# EasyEDA schematic SCH_circular-led_2022-01-28.json
TITLE: Sheet_1; REV: 1.0; Date: 2021-02-07; Sheet: 1/1; Drawn By: ferhat1709; Company: Your Company
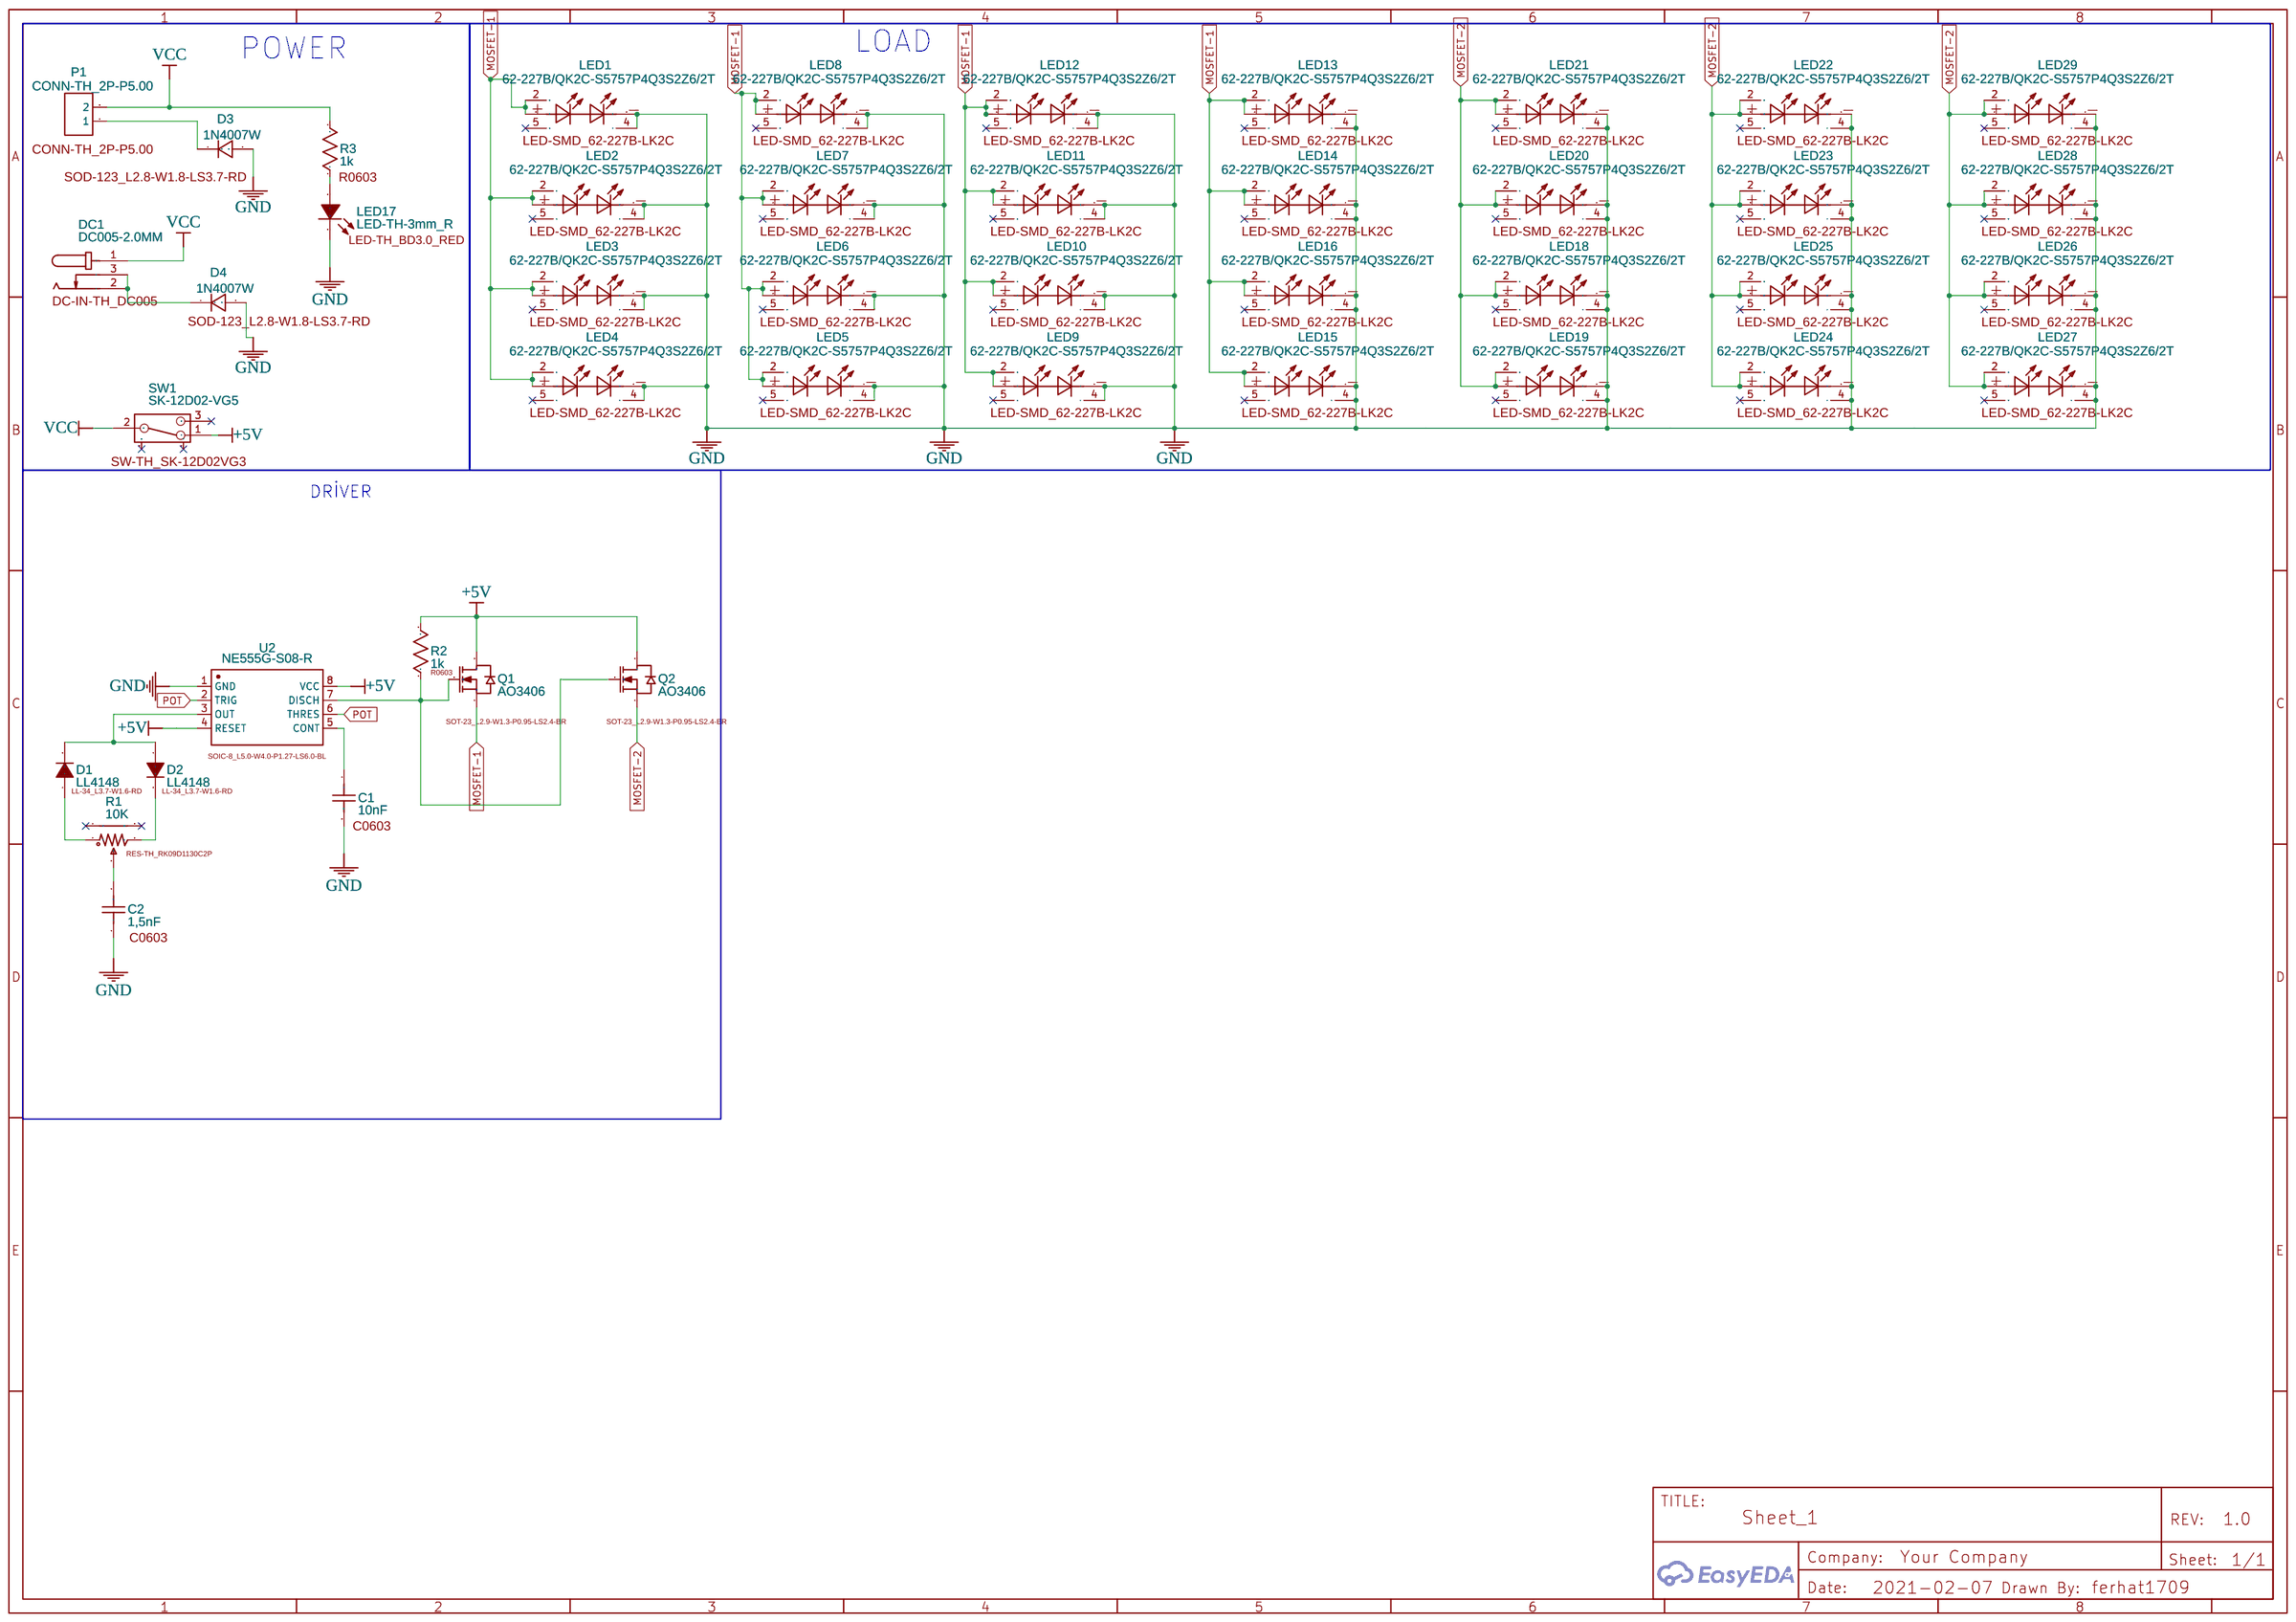
[diagram p0: schematic sheet]

## Parts
C1  10nF  [C0603]
C2  1,5nF  [C0603]
D1  LL4148  [LL-34_L3.7-W1.6-RD]
D2  LL4148  [LL-34_L3.7-W1.6-RD]
D3  1N4007W  [SOD-123_L2.8-W1.8-LS3.7-RD]
D4  1N4007W  [SOD-123_L2.8-W1.8-LS3.7-RD]
DC1  DC005-2.0MM  [DC-IN-TH_DC005]
LED1  62-227B/QK2C-S5757P4Q3S2Z6/2T  [LED-SMD_62-227B-LK2C]
LED2  62-227B/QK2C-S5757P4Q3S2Z6/2T  [LED-SMD_62-227B-LK2C]
LED3  62-227B/QK2C-S5757P4Q3S2Z6/2T  [LED-SMD_62-227B-LK2C]
LED4  62-227B/QK2C-S5757P4Q3S2Z6/2T  [LED-SMD_62-227B-LK2C]
LED5  62-227B/QK2C-S5757P4Q3S2Z6/2T  [LED-SMD_62-227B-LK2C]
LED6  62-227B/QK2C-S5757P4Q3S2Z6/2T  [LED-SMD_62-227B-LK2C]
LED7  62-227B/QK2C-S5757P4Q3S2Z6/2T  [LED-SMD_62-227B-LK2C]
LED8  62-227B/QK2C-S5757P4Q3S2Z6/2T  [LED-SMD_62-227B-LK2C]
LED9  62-227B/QK2C-S5757P4Q3S2Z6/2T  [LED-SMD_62-227B-LK2C]
LED10  62-227B/QK2C-S5757P4Q3S2Z6/2T  [LED-SMD_62-227B-LK2C]
LED11  62-227B/QK2C-S5757P4Q3S2Z6/2T  [LED-SMD_62-227B-LK2C]
LED12  62-227B/QK2C-S5757P4Q3S2Z6/2T  [LED-SMD_62-227B-LK2C]
LED13  62-227B/QK2C-S5757P4Q3S2Z6/2T  [LED-SMD_62-227B-LK2C]
LED14  62-227B/QK2C-S5757P4Q3S2Z6/2T  [LED-SMD_62-227B-LK2C]
LED15  62-227B/QK2C-S5757P4Q3S2Z6/2T  [LED-SMD_62-227B-LK2C]
LED16  62-227B/QK2C-S5757P4Q3S2Z6/2T  [LED-SMD_62-227B-LK2C]
LED17  LED-TH-3mm_R  [LED-TH_BD3.0_RED]
LED18  62-227B/QK2C-S5757P4Q3S2Z6/2T  [LED-SMD_62-227B-LK2C]
LED19  62-227B/QK2C-S5757P4Q3S2Z6/2T  [LED-SMD_62-227B-LK2C]
LED20  62-227B/QK2C-S5757P4Q3S2Z6/2T  [LED-SMD_62-227B-LK2C]
LED21  62-227B/QK2C-S5757P4Q3S2Z6/2T  [LED-SMD_62-227B-LK2C]
LED22  62-227B/QK2C-S5757P4Q3S2Z6/2T  [LED-SMD_62-227B-LK2C]
LED23  62-227B/QK2C-S5757P4Q3S2Z6/2T  [LED-SMD_62-227B-LK2C]
LED24  62-227B/QK2C-S5757P4Q3S2Z6/2T  [LED-SMD_62-227B-LK2C]
LED25  62-227B/QK2C-S5757P4Q3S2Z6/2T  [LED-SMD_62-227B-LK2C]
LED26  62-227B/QK2C-S5757P4Q3S2Z6/2T  [LED-SMD_62-227B-LK2C]
LED27  62-227B/QK2C-S5757P4Q3S2Z6/2T  [LED-SMD_62-227B-LK2C]
LED28  62-227B/QK2C-S5757P4Q3S2Z6/2T  [LED-SMD_62-227B-LK2C]
LED29  62-227B/QK2C-S5757P4Q3S2Z6/2T  [LED-SMD_62-227B-LK2C]
P1  CONN-TH_2P-P5.00  [CONN-TH_2P-P5.00]
Q1  AO3406  [SOT-23_L2.9-W1.3-P0.95-LS2.4-BR]
Q2  AO3406  [SOT-23_L2.9-W1.3-P0.95-LS2.4-BR]
R1  10K  [RES-TH_RK09D1130C2P]
R2  1k  [R0603]
R3  1k  [R0603]
SW1  SK-12D02-VG5  [SW-TH_SK-12D02VG3]
U2  NE555G-S08-R  [SOIC-8_L5.0-W4.0-P1.27-LS6.0-BL]

## Library data of the parts
C1 C2 = C_0603_US: Contributor: LCEDA_Lib; Package Display: Yes
D1 D2 = LL4148: Supplier: LCSC; Manufacturer: SEMTECH; image: //image.lceda.cn/szlcsc/C9808.jpg; Supplier Part: C9808; SMT Type: Basic; JLCPCB SMD: Yes; LCSC Assembly: Yes; Package Display: Yes
D3 D4 = 1N4007W: Supplier: LCSC; Supplier Part: C328592; Manufacturer: BLUE ROCKET; Contributor: LCEDA_Lib; Package Display: Yes
DC1 = DC005-2.0MM: Supplier: LCSC; Manufacturer: SOFNG; Supplier Part: C111567; Package Display: Yes
LED1-LED16 LED18-LED29 = 62-227B/QK2C-S5757P4Q3S2Z6/2T: Supplier: LCSC; Supplier Part: C282160; Manufacturer: Everlight Elec; Contributor: LCSC; Package Display: Yes
LED17 = LED-TH-3mm_R: Manufacturer: EVERLIGHT(台湾亿光); Manufacturer Part: 204-10SDRD/S530-A3-L; Supplier Part: C84774; Supplier: LCSC; Contributor: LCEDA_Lib; Package Display: Yes
P1 = CONN-TH_2P-P5.00: Supplier: LCSC; Contributor: LCEDA_Lib; Package Display: Yes
Q1 Q2 = AO3406: Supplier: LCSC; Supplier Part: C88051; Manufacturer: Alpha & Omega Semicon; Contributor: LCSC; Package Display: Yes
R1 = RK09D1130C2P: Supplier: LCSC; Supplier Part: C361173; Manufacturer: ALPS Electric; Contributor: LCSC; Package Display: Yes
R2 R3 = R_0603_US: Contributor: LCEDA_Lib; Package Display: Yes
SW1 = SK-12D02-VG5: Supplier: LCSC; Supplier Part: C136722; Manufacturer: Rectangular Connectors - Contacts; Contributor: LCSC; Package Display: Yes
U2 = NE555G-S08-R: Supplier: LCSC; Manufacturer: UTC; image: //image.lceda.cn/szlcsc/C75529.jpg; Supplier Part: C75529; SMT Type: Extend; JLCPCB SMD: Yes; LCSC Assembly: Yes; Package Display: Yes

## Nets
+5V: Q1.3(D) Q2.3(D) R2.2 SW1.1 U2.4(RESET) U2.8(VCC)
GND: C1.2 C2.1 D3.2 D4.2 LED1.1 LED1.4 LED2.1 LED2.4 LED3.1 LED3.4 LED4.1 LED4.4 LED5.1 LED5.4 LED6.1 LED6.4 LED7.1 LED7.4 LED8.1 LED8.4 LED9.1 LED9.4 LED10.1 LED10.4 LED11.1 LED11.4 LED12.1 LED12.4 LED13.1 LED13.4 LED14.1 LED14.4 LED15.1 LED15.4 LED16.1 LED16.4 LED17.2 LED18.1 LED18.4 LED19.1 LED19.4 LED20.1 LED20.4 LED21.1 LED21.4 LED22.1 LED22.4 LED23.1 LED23.4 LED24.1 LED24.4 LED25.1 LED25.4 LED26.1 LED26.4 LED27.1 LED27.4 LED28.1 LED28.4 LED29.1 LED29.4 U2.1(GND)
VCC: DC1.1 P1.2 R3.2 SW1.2
MOSFET-1: LED1.2 LED1.3 LED2.2 LED2.3 LED3.2 LED3.3 LED4.2 LED4.3 LED5.2 LED5.3 LED6.2 LED6.3 LED7.2 LED7.3 LED8.2 LED8.3 LED9.2 LED9.3 LED10.2 LED10.3 LED11.2 LED11.3 LED12.2 LED12.3 LED13.2 LED13.3 LED14.2 LED14.3 LED15.2 LED15.3 LED16.2 LED16.3 Q1.2(S)
MOSFET-2: LED18.2 LED18.3 LED19.2 LED19.3 LED20.2 LED20.3 LED21.2 LED21.3 LED22.2 LED22.3 LED23.2 LED23.3 LED24.2 LED24.3 LED25.2 LED25.3 LED26.2 LED26.3 LED27.2 LED27.3 LED28.2 LED28.3 LED29.2 LED29.3 Q2.2(S)
POT: U2.2(TRIG) U2.6(THRES)
Net-(C1-1): C1.1 U2.5(CONT)
Net-(C2-2): C2.2 R1.2
Net-(D1-1): D1.1(A) R1.1
Net-(D1-2): D1.2(K) D2.1(A) U2.3(OUT)
Net-(D2-2): D2.2(K) R1.3
Net-(D3-1): D3.1 P1.1
Net-(D4-1): D4.1 DC1.2 DC1.3
Net-(LED17-1): LED17.1 R3.1
Net-(Q1-1): Q1.1(G) Q2.1(G) R2.1 U2.7(DISCH)

Not connected (* = marked no-connect by the designer): LED1 5*; LED2 5*; LED3 5*; LED4 5*; LED5 5*; LED6 5*; LED7 5*; LED8 5*; LED9 5*; LED10 5*; LED11 5*; LED12 5*; LED13 5*; LED14 5*; LED15 5*; LED16 5*; LED18 5*; LED19 5*; LED20 5*; LED21 5*; LED22 5*; LED23 5*; LED24 5*; LED25 5*; LED26 5*; LED27 5*; LED28 5*; LED29 5*; R1 4* 5*; SW1 3* 4* 5*

## Notes on the sheet
- LOAD
- POWER
- DRİVER
